# Altium project DiplomaLZP_1.PrjPcb
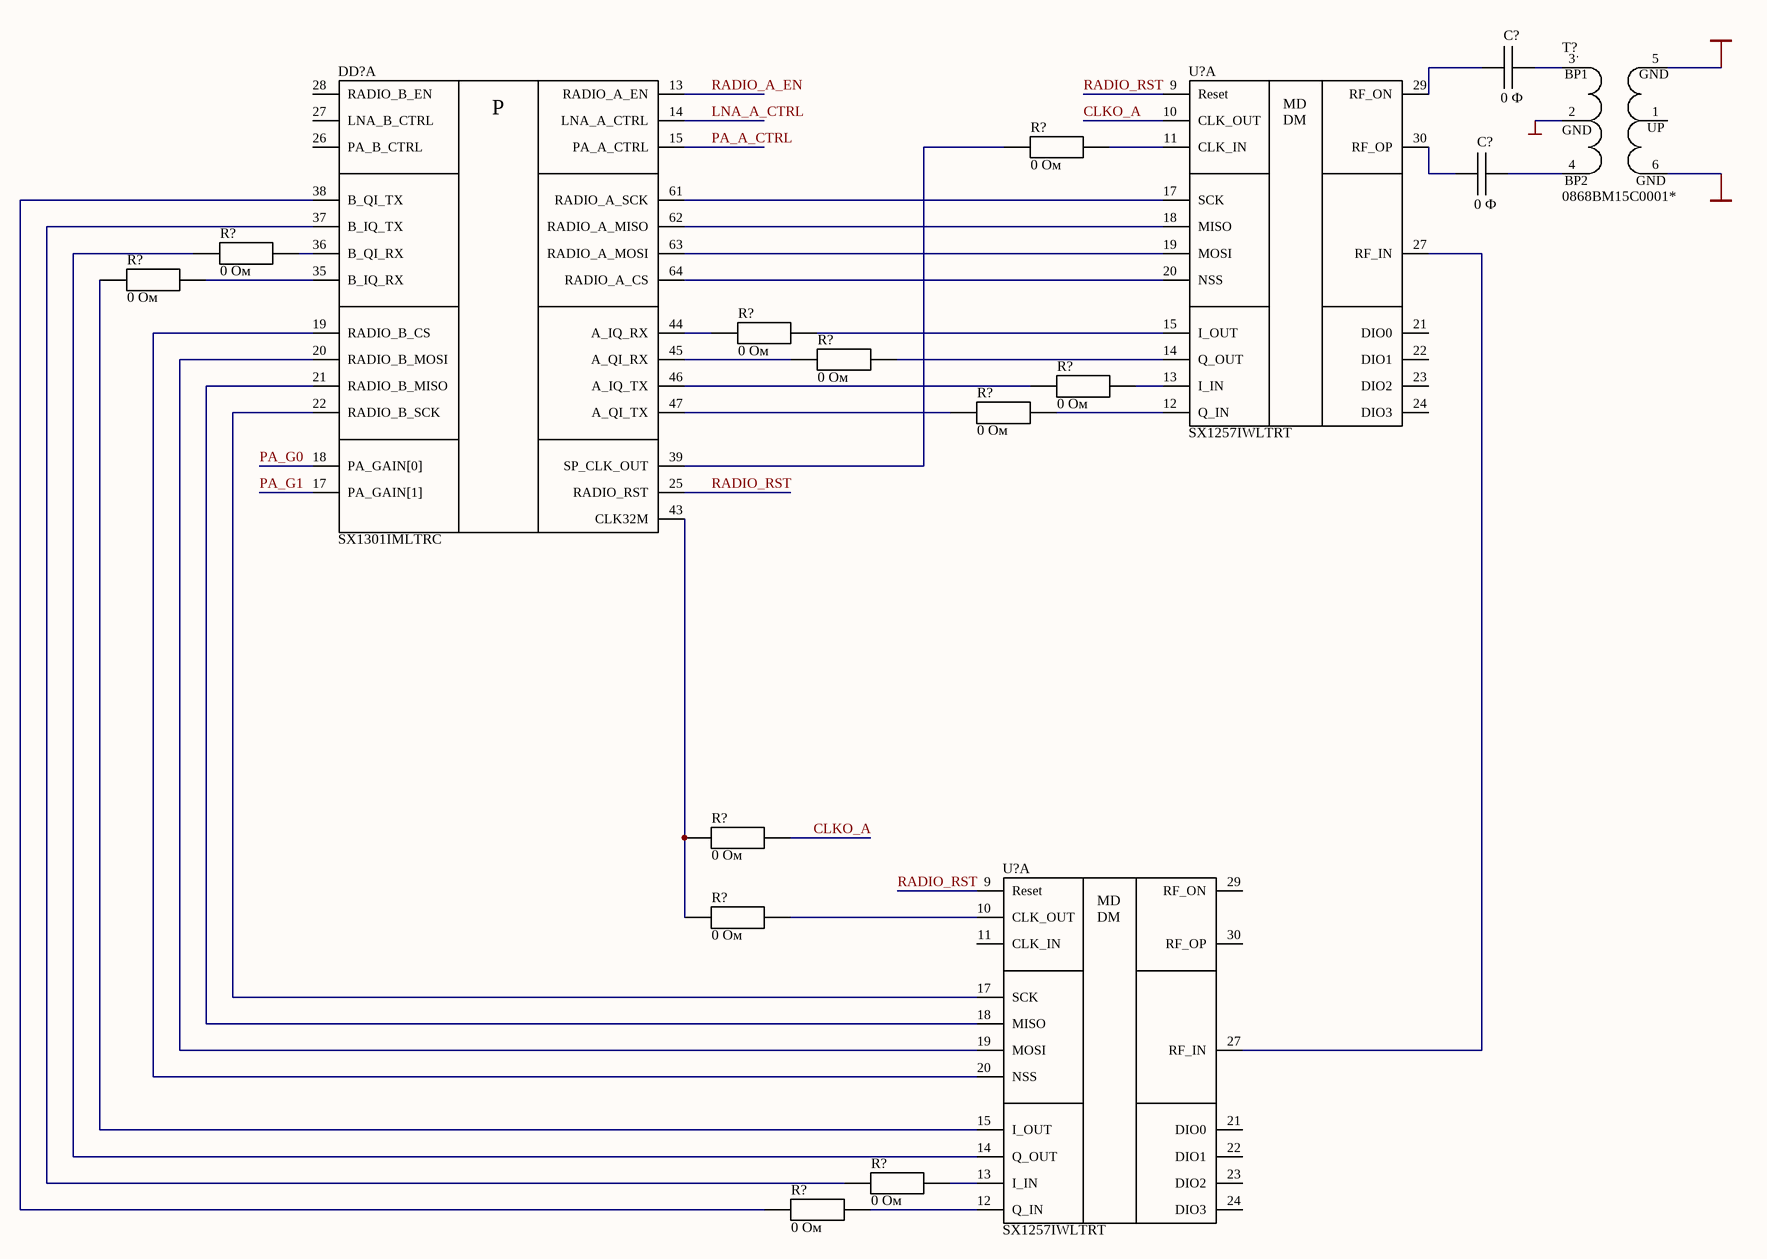
[diagram p0: МПСУ.464421.221 .SchDoc]
UZELxTitle: Плата; UZELxPERVxPrimenenie: МПСУ.464421.221; UZELxObozna4enie: МПСУ.464421.221; PCBxTYPExSB: СБ; PCBxTitle: Плата; PCBxObozna4enie: АЕСН.XXXXXX.***; PCBxIZMxT5M: 00
1 sheet, 17 parts. Net scope: global (net labels, ports and power ports of the same name join across sheets).

## Sheet МПСУ.464421.221 .SchDoc
size 594 x 420 mm; ApprovedBy: Орешкин; Author: Лазба; DrawnBy: Лазба; Engineer: Лазба; Organization: МИЭТ; Address1: Address1; Address2: Address2; Address3: Address3; Address4: Address4; SheetNumber: 1; SheetTotal: 1; DocumentName1SCH: Плата; DocumentName2SCH: Схема электрическая; DocumentName3SCH: принципиальная; UtverjdenNumberSCH: МПСУ.464421.221; PervichnoePrimenenieSCH: МПСУ.464421.221; UtverjdenSCH: Утвержден; DocumentTypeSCH: Э3; OboznachenieSCH: МПСУ.464421.221; NachOtdelaSCH: Орешкин

### Parts
(Parts that share a designator on the sheet are numbered #1, #2 ... from top to bottom, then left to right.)
C?#1  value 0 Ф  [CAPC0201X03L]
C?#2  value 0 Ф  [CAPC0201X03L]
DD?  SX1301IMLTRC  [SX1301IMLTRC]  (part A of 2)
R?#1  value 0 Ом  [RESC0201X03L]
R?#2  value 0 Ом  [RESC0201X03L]
R?#3  value 0 Ом  [RESC0201X03L]
R?#4  value 0 Ом  [RESC0201X03L]
R?#5  value 0 Ом  [RESC0201X03L]
R?#6  value 0 Ом  [RESC0201X03L]
R?#7  value 0 Ом  [RESC0201X03L]
R?#8  value 0 Ом  [RESC0201X03L]
R?#9  value 0 Ом  [RESC0201X03L]
R?#10  value 0 Ом  [RESC0201X03L]
R?#11  value 0 Ом  [RESC0201X03L]
T?  0868BM15C0001*  [LCC065P125X200X085-6]
U?#1  SX1257IWLTRT  [SX1257IWLTRT]  (part A of 2)
U?#2  SX1257IWLTRT  [SX1257IWLTRT]  (part A of 2)

### Nets
GND: T?.2(GND) T?.5(GND) T?.6(GND)
CLKO_A: R?#8.2 U?#1.10(CLK_OUT)
LNA_A_CTRL: DD?.14(LNA_A_CTRL)
PA_A_CTRL: DD?.15(PA_A_CTRL)
PA_G0: DD?.18(PA_GAIN[0])
PA_G1: DD?.17(PA_GAIN[1])
RADIO_A_EN: DD?.13(RADIO_A_EN)
RADIO_RST: DD?.25(RADIO_RST) U?#1.9(Reset) U?#2.9(Reset)
NetC?#1_1: C?#1.1 U?#1.29(RF_ON)
NetC?#1_2: C?#1.2 T?.3(BP1)
NetC?#2_1: C?#2.1 U?#1.30(RF_OP)
NetC?#2_2: C?#2.2 T?.4(BP2)
NetDD?_19: DD?.19(RADIO_B_CS) U?#2.20(NSS)
NetDD?_20: DD?.20(RADIO_B_MOSI) U?#2.19(MOSI)
NetDD?_21: DD?.21(RADIO_B_MISO) U?#2.18(MISO)
NetDD?_22: DD?.22(RADIO_B_SCK) U?#2.17(SCK)
NetDD?_35: DD?.35(B_IQ_RX) R?#3.2
NetDD?_36: DD?.36(B_QI_RX) R?#2.2
NetDD?_37: DD?.37(B_IQ_TX) R?#10.1
NetDD?_38: DD?.38(B_QI_TX) R?#11.1
NetDD?_39: DD?.39(SP_CLK_OUT) R?#1.1
NetDD?_43: DD?.43(CLK32M) R?#8.1 R?#9.1
NetDD?_44: DD?.44(A_IQ_RX) R?#4.1
NetDD?_45: DD?.45(A_QI_RX) R?#5.1
NetDD?_46: DD?.46(A_IQ_TX) R?#6.1
NetDD?_47: DD?.47(A_QI_TX) R?#7.1
NetDD?_61: DD?.61(RADIO_A_SCK) U?#1.17(SCK)
NetDD?_62: DD?.62(RADIO_A_MISO) U?#1.18(MISO)
NetDD?_63: DD?.63(RADIO_A_MOSI) U?#1.19(MOSI)
NetDD?_64: DD?.64(RADIO_A_CS) U?#1.20(NSS)
NetR?#1_2: R?#1.2 U?#1.11(CLK_IN)
NetR?#2_1: R?#2.1 U?#2.14(Q_OUT)
NetR?#3_1: R?#3.1 U?#2.15(I_OUT)
NetR?#4_2: R?#4.2 U?#1.15(I_OUT)
NetR?#5_2: R?#5.2 U?#1.14(Q_OUT)
NetR?#6_2: R?#6.2 U?#1.13(I_IN)
NetR?#7_2: R?#7.2 U?#1.12(Q_IN)
NetR?#9_2: R?#9.2 U?#2.10(CLK_OUT)
NetR?#10_2: R?#10.2 U?#2.13(I_IN)
NetR?#11_2: R?#11.2 U?#2.12(Q_IN)
NetU?#1_27: U?#1.27(RF_IN) U?#2.27(RF_IN)

Not connected (* = marked no-connect by the designer): DD? 26(PA_B_CTRL) 27(LNA_B_CTRL) 28(RADIO_B_EN); T? 1(UP); U?#1 21(DIO0) 22(DIO1) 23(DIO2) 24(DIO3); U?#2 11(CLK_IN) 21(DIO0) 22(DIO1) 23(DIO2) 24(DIO3) 29(RF_ON) 30(RF_OP)

### Notes on the sheet
- Перв. примен.
- Справ. №
- Подп. и дата
- Инв. № дубл.
- Взам. инв. №
- Разраб.
- Изм.
- Лист
- № докум.
- Подп.
- Дата
- Лит.
- Масса
- Масштаб
- Пров.
- Т.контр.
- Листов
- Инв. № подл.
- Утв.
- Н.контр.
- Нач. отд.
- Копировал
- Формат А2
- (in symbol SX1257IWLTRT, part A) MD / DM
- (in symbol SX1301IMLTRC, part A) P

### Library data of the parts
C?#1 C?#2 = C 0201: Capacitor 0201; Tolerance: 0 %; Designer: Погорельский; 3D_Body: +; Category: Passive; Subcategory: Capacitor; Status: Notes
DD? = SX1301IMLTRC: LoRa Core™ Digital Baseband Chip for outdoor LoRaWAN® network macro gateways; Manufacturer: Semtech; Designer: Лазба; 3D_Body: +; ComponentLink1Description: Техническое описание; ComponentLink1URL: Q:\Libs\Descriptions_PDF\DS_SX1301_V2_4_W.pdf; Category: IC; Subcategory: BPP; Status: Check; Package: QFN64; PartNumber: SX1301IMLTRC
R?#1-R?#11 = R 0201: Resistor 0201; Designer: Свидерский; 3D_Body: +; Tolerance: 0 %; Peak_Condition: 0 Вт; Category: Passive; Subcategory: Resistor; Status: Approved
T? = 0868BM15C0001*: 868MHz Center Frequency Balun/Filter for high frequency ceramic solutions 10MHz Bandwidth 0.5dB 0805 (2012 Metric), 8 PC Pad; Manufacturer: Johanson Technology Inc.; Designer: Лазба; 3D_Body: +; ComponentLink1Description: Техническое описание; ComponentLink1URL: Q:\Libs\Descriptions_PDF\0868BM15C0001.pdf; Category: Passive; Subcategory: Filter; Status: Check; PartNumber: 0868BM15C0001*
U?#1 U?#2 = SX1257IWLTRT: LoRa Core™ Low Power Digital I and Q RF Multi-PHY Mode Analog Front End 860-1000MHz; Manufacturer: Semtech; Designer: Лазба; 3D_Body: +; ComponentLink1Description: Техническое описание; ComponentLink1URL: Q:\Libs\Descriptions_PDF\DS_SX1257_V1.2.pdf; Category: IC; Subcategory: Transciever; Status: Check; Package: QFN32; PartNumber: SX1257IWLTRT